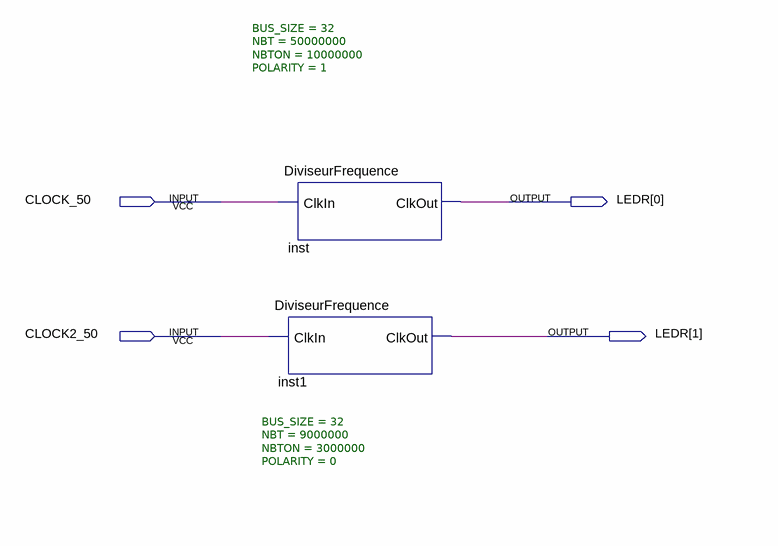
[diagram p0: schematic sheet]
// Quartus schematic DiviseurFrequence_DE2_115.bdf as structural Verilog: 2 symbols, 4 pins
module DiviseurFrequence_DE2_115 (
  input  CLOCK_50,
  input  CLOCK2_50,
  output [1:0] LEDR
);

  DiviseurFrequence #(.BUS_SIZE(32), .NBT(9000000), .NBTON(3000000), .POLARITY(0)) inst1 (
    .ClkIn(CLOCK2_50), .ClkOut(LEDR[1]));
  DiviseurFrequence #(.BUS_SIZE(32), .NBT(50000000), .NBTON(10000000), .POLARITY(1)) inst (
    .ClkIn(CLOCK_50), .ClkOut(LEDR[0]));
endmodule
